# Altium schematic sheet MAX30101.SchDoc: MAX30101 Schematic
size A4; SheetNumber: 3; SheetTotal: 8
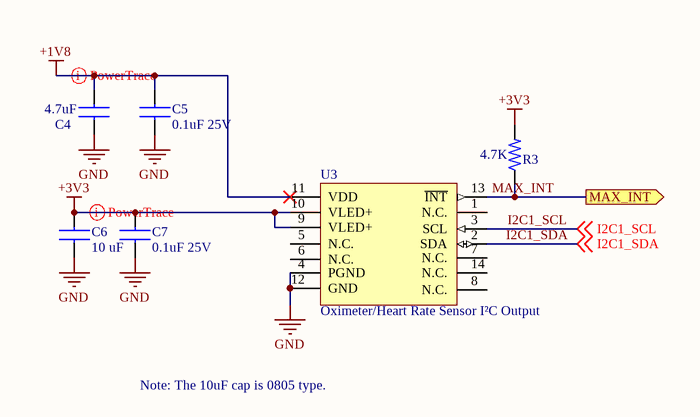
[diagram p0: MAX30101.SchDoc]

## Parts
C4  4.7uF  [Chip2Pin_CAP_2_1.6x0.8]
C5  0.1uF 25V  [Chip2Pin_1.6x0.8x0.9_CAP]
C6  10 uF  [GRM21BR61E106KA73K]
C7  0.1uF 25V  [Chip2Pin_1.6x0.8x0.9_CAP]
R3  4.7K  [RES_0603_1608X06]
U3  Oximeter/Heart Rate Sensor I²C Output  [14-DFN-5.6x3.3]

## Ports
MAX_INT (out, see EFR32BG13_IO_Port_Pins[1B])

## Nets
+1V8: C4.1 C5.1 U3.11(VDD)
+3V3: C6.1 C7.1 R3.2 U3.9(VLED+) U3.10(VLED+)
GND: C4.2 C5.2 C6.2 C7.2 U3.4(PGND) U3.12(GND)
I2C1_SCL: U3.3(SCL) ; off-sheet I2C1_SCL
I2C1_SDA: U3.2(SDA) ; off-sheet I2C1_SDA
MAX_INT: R3.1 U3.13(~{INT}) ; port MAX_INT

Not connected (* = marked no-connect by the designer): U3 1(N.C.) 5(N.C.) 6(N.C.) 7(N.C.) 8(N.C.) 14(N.C.)

## Layout directives
rule Width Constraint [Pref Width = 20mil    Min Width = 10mil    Max Width = 20mil]: +1V8, +3V3

## Notes on the sheet
- Note: The 10uF cap is 0805 type.

## Library data of the parts
C4 = GRM188Z71C475KE21D: Cap Ceramic 4.7uF 16V X7R 10% SMD 0603 125°C Paper T/R; Manufacturer: Murata; Supplier 1: Arrow Electronics; Manufacturer Part Number: GRM188Z71C475KE21D; RoHS: Yes; Category: Ceramic Capacitors; Stock 1: 80000; Pricing 1: 4000=0.05770, 8000=0.04270 (USD); RoHS Compliant: Yes
C5 C7 = GCJ188R71E104KA12D: Cap Ceramic 0.1uF 25V X7R 10% Pad SMD 0603 Soft Termination 125C Automotive T/R; Manufacturer: Murata; Value: 100nF; Supplier 1: Arrow Electronics; Manufacturer Part Number: GCJ188R71E104KA12D; RoHS: Yes; Category: Ceramic Capacitors; Stock 1: 11360; Pricing 1: 1=0.14710, 10=0.11710, 25=0.11140, 100=0.11030, 250=0.10920, 500=0.10810, 1000=0.10700, 3000=0.10600, 6000=0.10490 (USD); Mounting Technology: Surface Mount; Case/Package: 0603; Case Code (Imperial): 0603; Case Code (Metric): 1608; Min Operating Temperature: -55°C; Max Operating Temperature: 125°C; Features: Soft Termination; Packaging: Tape and Reel; Tolerance: 10%; Voltage Rating: 25V; Ratings: AEC-Q200; RoHS Compliant: Yes; ComponentLink1URL: http://search.murata.co.jp/Ceramy/image/img/A01X/G101/ENG/GCJ188R71E104KA12-01.pdf?src-supplier=Digi-Key; ComponentLink1Description: http://search.murata.co.jp/Ceramy/image/img/A01X/G101/ENG/GCJ188R71E104KA12-01.pdf?src-supplier=Digi-Key
C6 = GRM21BR61E106KA73K: 0805 25 V 10 uF ±20% Tolerance X5R Monolithic Ceramic Chip Capacitor; Manufacturer: Murata; Value: 10uF; Voltage Rating: 25V; Tolerance: 10%; Supplier 1: Newark; Manufacturer Part Number: GRM21BR61E106KA73K; RoHS: Yes; Category: Ceramic Capacitors; Stock 1: 7277; Pricing 1: 1=0.21000, 10=0.08700, 25=0.08200, 50=0.07800, 100=0.07300 (USD); Mounting Technology: Surface Mount; Case/Package: 0805; Weight: 0.000335oz; Min Operating Temperature: -55°C; Max Operating Temperature: 85°C; Packaging: Tape and Reel; Package Quantity: 10000; Dielectric: X5R; Voltage Rating (DC): 25V; Length: 0.079inch; Width: 0.049inch; Thickness: 0.055inch; RoHS Compliant: Yes; ComponentLink1URL: http://www.mouser.com/ds/2/281/c02e-2905.pdf?src-supplier=Mouser; ComponentLink1Description: http://www.mouser.com/ds/2/281/c02e-2905.pdf?src-supplier=Mouser; ComponentLink2URL: http://search.murata.co.jp/Ceramy/image/img/A01X/G101/ENG/GRM21BR61E106KA73-01.pdf?src-supplier=Digi-Key; ComponentLink2Description: http://search.murata.co.jp/Ceramy/image/img/A01X/G101/ENG/GRM21BR61E106KA73-01.pdf?src-supplier=Digi-Key; ComponentLink3URL: https://search.murata.co.jp/Ceramy/image/img/A01X/G101/ENG/GRM21BR61E106KA73-01.pdf?src-supplier=Digi-Key; ComponentLink3Description: https://search.murata.co.jp/Ceramy/image/img/A01X/G101/ENG/GRM21BR61E106KA73-01.pdf?src-supplier=Digi-Key
R3 = RC0603JR-074K7L: Res General Purpose Thick Film 0603 4.7k Ohm 5% 1/10W ±100ppm/°C Molded Paper T/R; Manufacturer: Yageo; Voltage Rating (DC): 50V; Value: 4.7kR; Power Rating: 100mW; Supplier 1: Future Electronics; Manufacturer Part Number: RC0603JR-074K7L; RoHS: Yes; Category: Chip SMD Resistors; Stock 1: 36770000; Pricing 1: 5000=0.00120, 75000=0.00110, 200000=0.00110, 750000=0.00100, 2000000=0.00100 (USD); Case/Package: 0603; Pins: 2; Case Code (Imperial): 0603; Case Code (Metric): 1608; Min Operating Temperature: -55°C; Max Operating Temperature: 155°C; Tolerance: 5%; Voltage Rating: 50V; Packaging: Tape and Reel; Termination: SMD/SMT; Resistor Type: Thick Film; Temperature Coefficient: 100ppm/°C; Features: Moisture Resistant; Max Power Dissipation: 100mW; Number of Terminations: 2; Series: RC; Resistance Tolerance: 5%; Construction: Rectangular; Length: 1.6mm; Width: 0.8mm; Depth: 0.8mm; Reach SVHC Compliant: Yes; Military Standard: Not; Lead Free: Lead Free; RoHS Compliant: Yes; ComponentLink1URL: https://datasheet.ciiva.com/46412/443971-46412858.pdf?src-supplier=Element14; ComponentLink1Description: https://datasheet.ciiva.com/46412/443971-46412858.pdf?src-supplier=Element14
U3 = MAX30101EFD+T: Integrated Optical Sensor; Manufacturer: Analog Devices; Supplier 1: Newark; Manufacturer Part Number: MAX30101EFD+T; RoHS: No; Category: Uncategorized; Stock 1: 2505; Pricing 1: 1=11.21000, 10=10.13000, 25=9.66000, 50=9.02000, 100=8.38000, 250=8.01000, 500=7.30000, 1000=7.07000 (USD)